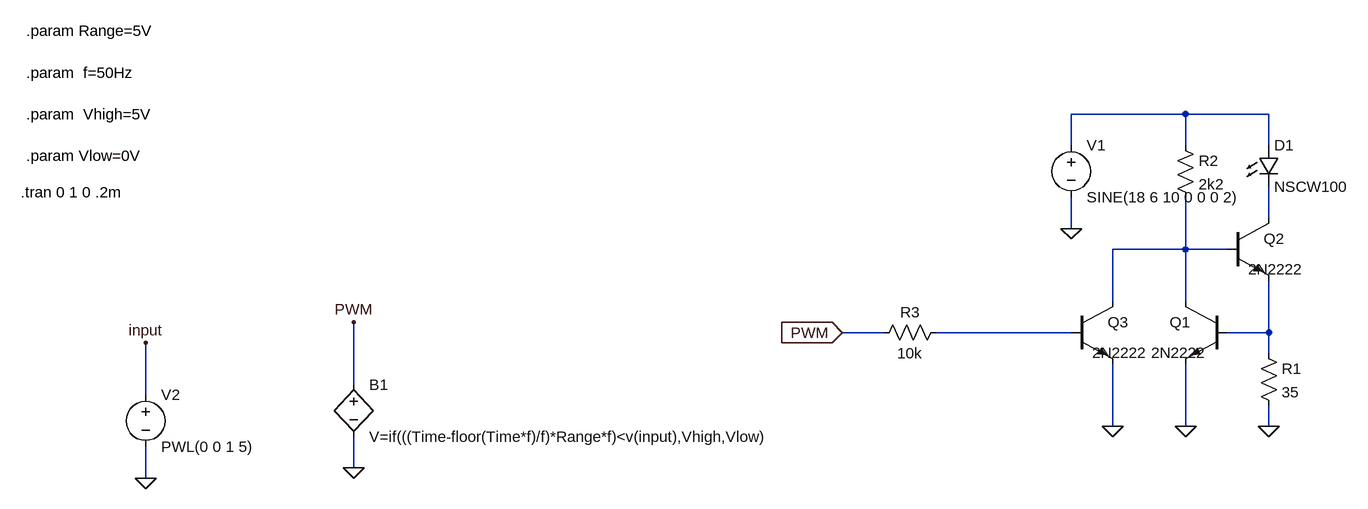
[diagram p0: schematic cc_led_driver_bipolar.asc]
cc_led_driver_bipolar.asc, the LTspice schematic file:
Version 4
SHEET 1 880 680
WIRE 528 0 352 0
WIRE 656 0 528 0
WIRE 352 48 352 0
WIRE 528 48 528 0
WIRE 656 48 656 0
WIRE 656 160 656 112
WIRE 352 176 352 128
WIRE 528 208 528 128
WIRE 528 208 416 208
WIRE 592 208 528 208
WIRE 416 288 416 208
WIRE 528 288 528 208
WIRE 64 336 0 336
WIRE 192 336 144 336
WIRE 352 336 192 336
WIRE 656 336 656 256
WIRE 656 336 592 336
WIRE 656 368 656 336
WIRE -752 416 -752 320
WIRE -1072 432 -1072 352
WIRE 416 480 416 384
WIRE 528 480 528 384
WIRE 656 480 656 448
WIRE -752 544 -752 496
WIRE -1072 560 -1072 512
FLAG 656 480 0
FLAG 528 480 0
FLAG 352 176 0
FLAG 0 336 PWM
IOPIN 0 336 In
FLAG -1072 560 0
FLAG -1072 352 input
FLAG -752 544 0
FLAG -752 320 PWM
FLAG 416 480 0
DATAFLAG 192 336 ""
SYMBOL npn 592 288 M0
WINDOW 3 32 79 Left 2
SYMATTR Value 2N2222
SYMATTR InstName Q1
SYMBOL res 640 352 R0
SYMATTR InstName R1
SYMATTR Value 35
SYMATTR SpiceLine pwr=1
SYMBOL res 512 32 R0
SYMATTR InstName R2
SYMATTR Value 2k2
SYMBOL voltage 352 32 R0
WINDOW 123 0 0 Left 2
WINDOW 39 0 0 Left 2
SYMATTR InstName V1
SYMATTR Value SINE(18 6 10 0 0 0 2)
SYMBOL LED 640 48 R0
SYMATTR InstName D1
SYMATTR Value NSCW100
SYMATTR Description Diode
SYMATTR Type diode
SYMBOL npn 592 160 R0
WINDOW 3 32 79 Left 2
SYMATTR Value 2N2222
SYMATTR InstName Q2
SYMBOL res 160 320 R90
WINDOW 0 0 56 VBottom 2
WINDOW 3 32 56 VTop 2
SYMATTR InstName R3
SYMATTR Value 10k
SYMBOL voltage -1072 416 R0
WINDOW 123 0 0 Left 2
WINDOW 39 0 0 Left 2
SYMATTR InstName V2
SYMATTR Value PWL(0 0 1 5)
SYMBOL bv -752 400 R0
SYMATTR InstName B1
SYMATTR Value V=if(((Time-floor(Time*f)/f)*Range*f)<v(input),Vhigh,Vlow)
SYMBOL npn 352 288 R0
WINDOW 3 32 79 Left 2
SYMATTR Value 2N2222
SYMATTR InstName Q3
TEXT -1256 -128 Left 2 !.param Range=5V
TEXT -1256 -64 Left 2 !.param  f=50Hz
TEXT -1256 0 Left 2 !.param  Vhigh=5V
TEXT -1256 64 Left 2 !.param Vlow=0V
TEXT -1264 120 Left 2 !.tran 0 1 0 .2m

The netlist it stands for:
* cc_led_driver_bipolar.asc
Q1 N003 N005 0 0 2N2222
R1 N005 0 35 pwr=1
R2 N001 N003 2k2
V1 N001 0 SINE(18 6 10 0 0 0 2)
D1 N001 N002 NSCW100
Q2 N002 N003 N005 0 2N2222
R3 N004 PWM 10k
V2 input 0 PWL(0 0 1 5)
B1 PWM 0 V=if(((Time-floor(Time*f)/f)*Range*f)<v(input),Vhigh,Vlow)
Q3 N003 N004 0 0 2N2222
.model D D
.lib standard.dio
.model NPN NPN
.model PNP PNP
.lib standard.bjt
.param Range=5V
.param  f=50Hz
.param  Vhigh=5V
.param Vlow=0V
.tran 0 1 0 .2m
.backanno
.end